# EAGLE design confBadgeV1 (EAGLE 9.6.2)
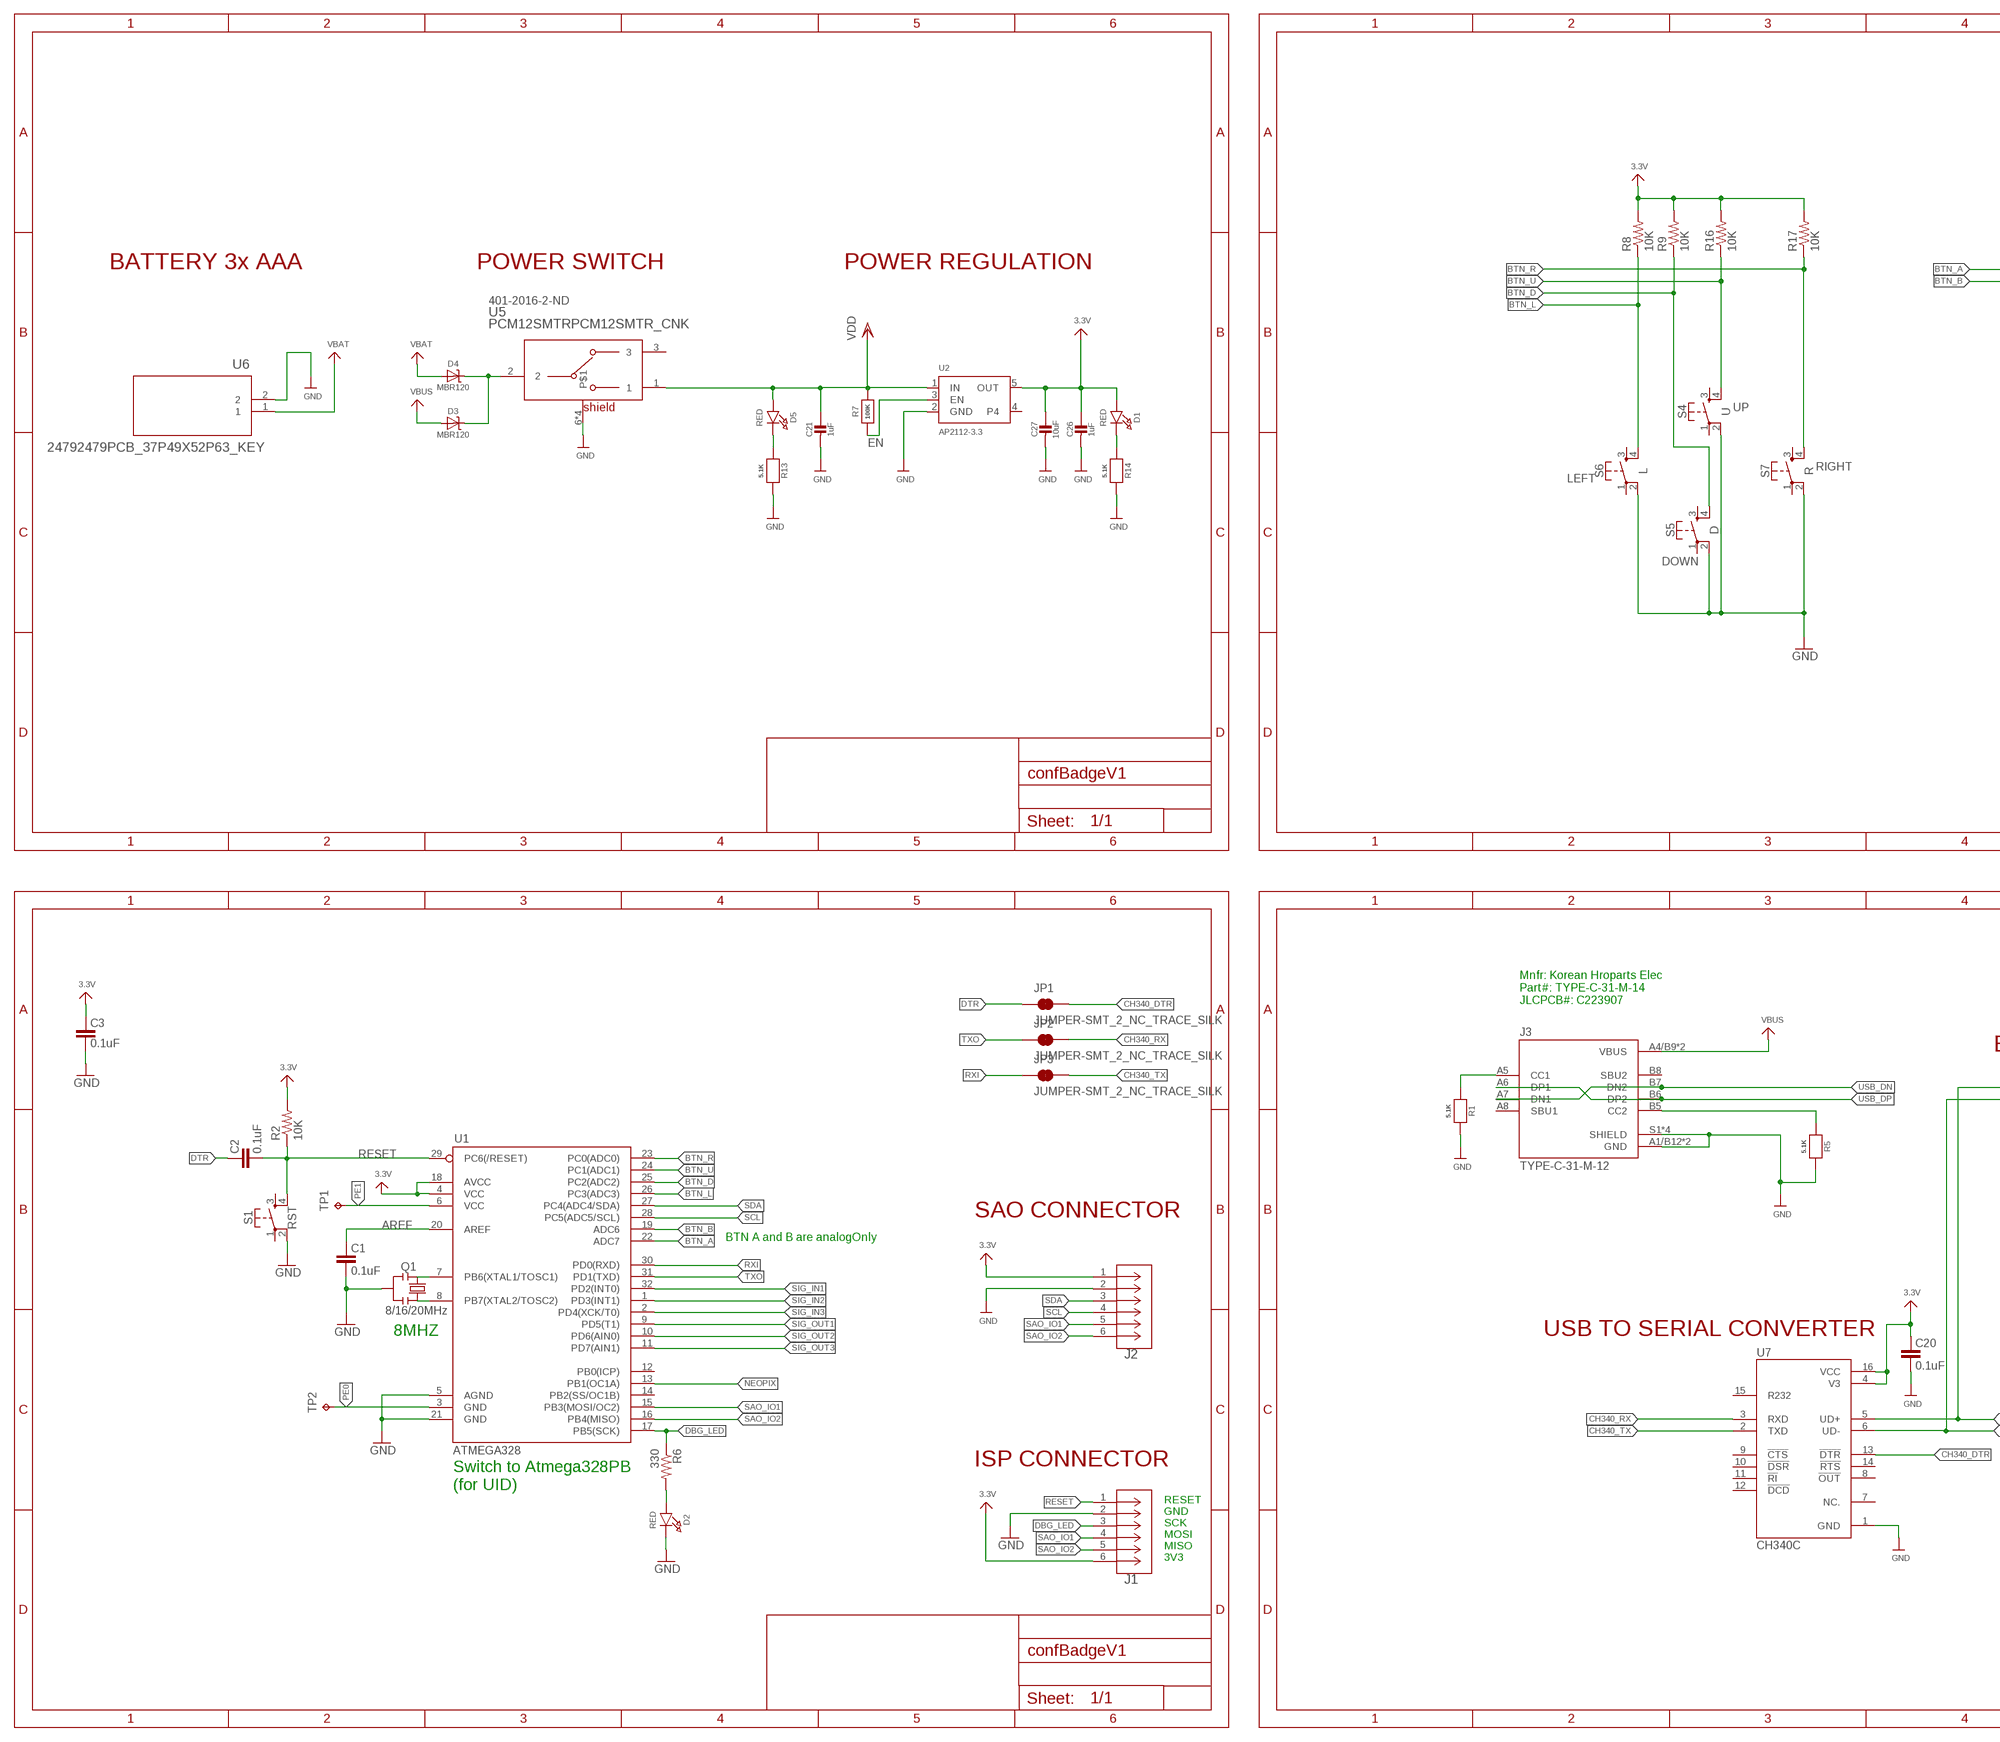
[diagram p0: schematic, sheet 1, part 1 of 2]
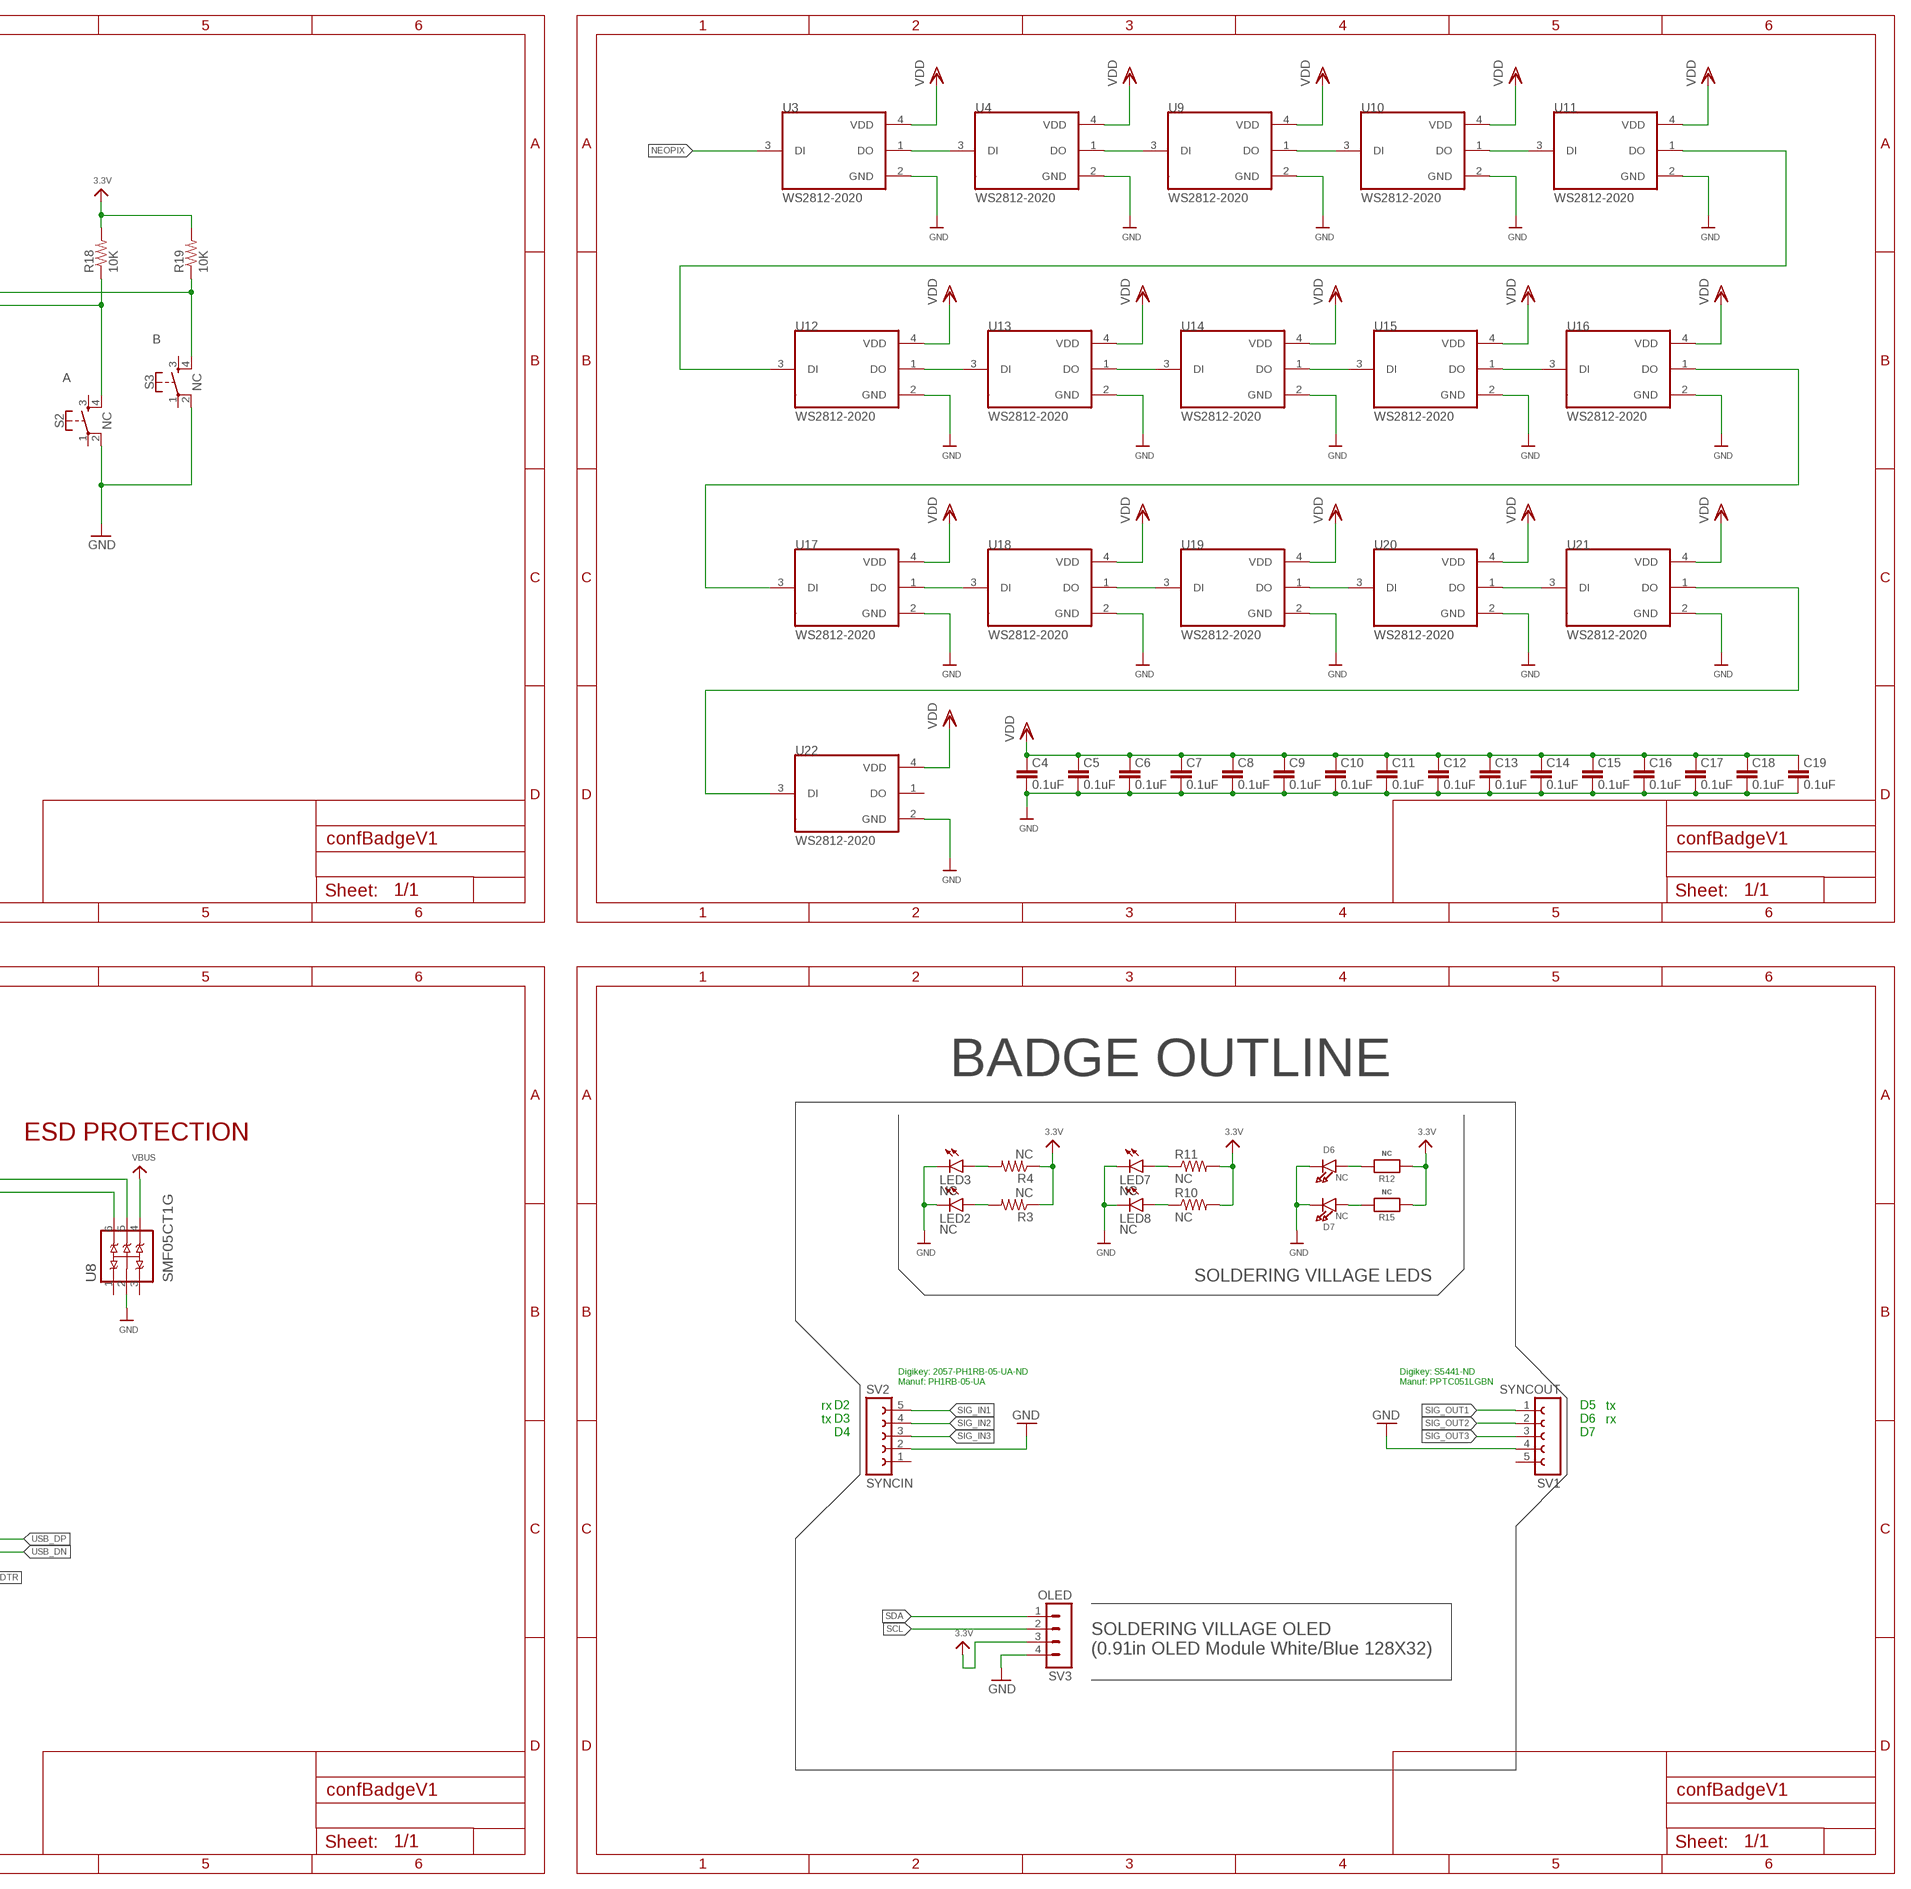
[diagram p1: schematic, sheet 1, part 2 of 2]

## Parts
C1  0.1uF  CAP0603-CAP  [0603-CAP]
C2  0.1uF  CAP0603-CAP  [0603-CAP]
C3  0.1uF  CAP0603-CAP  [0603-CAP]
C4  0.1uF  CAP0603-CAP  [0603-CAP]
C5  0.1uF  CAP0603-CAP  [0603-CAP]
C6  0.1uF  CAP0603-CAP  [0603-CAP]
C7  0.1uF  CAP0603-CAP  [0603-CAP]
C8  0.1uF  CAP0603-CAP  [0603-CAP]
C9  0.1uF  CAP0603-CAP  [0603-CAP]
C10  0.1uF  CAP0603-CAP  [0603-CAP]
C11  0.1uF  CAP0603-CAP  [0603-CAP]
C12  0.1uF  CAP0603-CAP  [0603-CAP]
C13  0.1uF  CAP0603-CAP  [0603-CAP]
C14  0.1uF  CAP0603-CAP  [0603-CAP]
C15  0.1uF  CAP0603-CAP  [0603-CAP]
C16  0.1uF  CAP0603-CAP  [0603-CAP]
C17  0.1uF  CAP0603-CAP  [0603-CAP]
C18  0.1uF  CAP0603-CAP  [0603-CAP]
C19  0.1uF  CAP0603-CAP  [0603-CAP]
C20  0.1uF  CAP0603-CAP  [0603-CAP]
C21  1uF  CAP_CERAMIC0603_NO  [0603-NO]
C26  1uF  CAP_CERAMIC0603_NO  [0603-NO]
C27  10uF  CAP_CERAMIC0805-NOOUTLINE  [0805-NO]
D1  RED  LED0805_NOOUTLINE  [CHIPLED_0805_NOOUTLINE]
D2  RED  LED0805_NOOUTLINE  [CHIPLED_0805_NOOUTLINE]
D3  MBR120  DIODE-SCHOTTKYSOD-123  [SOD-123]
D4  MBR120  DIODE-SCHOTTKYSOD-123  [SOD-123]
D5  RED  LED0805_NOOUTLINE  [CHIPLED_0805_NOOUTLINE]
D6  NC  LED0805_NOOUTLINE  [CHIPLED_0805_NOOUTLINE]
D7  NC  LED0805_NOOUTLINE  [CHIPLED_0805_NOOUTLINE]
J1  SSW-103-22-F-D-VS-K-TRCON3_SSW-D-DUMZ_HDR_SAI  [CON3_SSW-D-DUMZ_HDR_SAI]
J2  SSW-103-22-F-D-VS-K-TRCON3_SSW-D-DUMZ_HDR_SAI  [CON3_SSW-D-DUMZ_HDR_SAI]
J3  TYPE-C-31-M-12  [HRO_TYPE-C-31-M-12]
JP1  JUMPER-SMT_2_NC_TRACE_SILK  [SMT-JUMPER_2_NC_TRACE_SILK]
JP2  JUMPER-SMT_2_NC_TRACE_SILK  [SMT-JUMPER_2_NC_TRACE_SILK]
JP3  JUMPER-SMT_2_NC_TRACE_SILK  [SMT-JUMPER_2_NC_TRACE_SILK]
LED2  NC  LED3MM  [LED3MM]
LED3  NC  LED3MM  [LED3MM]
LED7  NC  LEDCHIPLED_1206  [CHIPLED_1206]
LED8  NC  LEDCHIPLED_1206  [CHIPLED_1206]
Q1  8/16/20MHz  RESONATOR1:1  [RESONATOR-SMD-1:1]
R1  5.1K  RESISTOR_0603_NOOUT  [0603-NO]
R2  10K  RESISTOR0603-RES  [0603-RES]
R3  NC  R-US_0207/10  [0207/10]
R4  NC  R-US_0207/10  [0207/10]
R5  5.1K  RESISTOR_0603_NOOUT  [0603-NO]
R6  330  RESISTOR0603-RES  [0603-RES]
R7  100K  RESISTOR_0603_NOOUT  [0603-NO]
R8  10K  RESISTOR0603-RES  [0603-RES]
R9  10K  RESISTOR0603-RES  [0603-RES]
R10  NC  R-US_R1206W  [R1206W]
R11  NC  R-US_R1206W  [R1206W]
R12  NC  RESISTOR_0603_NOOUT  [0603-NO]
R13  5.1K  RESISTOR_0603_NOOUT  [0603-NO]
R14  5.1K  RESISTOR_0603_NOOUT  [0603-NO]
R15  NC  RESISTOR_0603_NOOUT  [0603-NO]
R16  10K  RESISTOR0603-RES  [0603-RES]
R17  10K  RESISTOR0603-RES  [0603-RES]
R18  10K  RESISTOR0603-RES  [0603-RES]
R19  10K  RESISTOR0603-RES  [0603-RES]
S1  RST  MOMENTARY-SWITCH-SPST-2-SMD-5.2MM  [TACTILE_SWITCH_SMD_5.2MM]
S2  NC  MOMENTARY-SWITCH-SPST-2-SMD-5.2MM  [TACTILE_SWITCH_SMD_5.2MM]
S3  NC  MOMENTARY-SWITCH-SPST-2-SMD-5.2MM  [TACTILE_SWITCH_SMD_5.2MM]
S4  U  MOMENTARY-SWITCH-SPST-2-SMD-5.2MM  [TACTILE_SWITCH_SMD_5.2MM]
S5  D  MOMENTARY-SWITCH-SPST-2-SMD-5.2MM  [TACTILE_SWITCH_SMD_5.2MM]
S6  L  MOMENTARY-SWITCH-SPST-2-SMD-5.2MM  [TACTILE_SWITCH_SMD_5.2MM]
S7  R  MOMENTARY-SWITCH-SPST-2-SMD-5.2MM  [TACTILE_SWITCH_SMD_5.2MM]
SV1  SYNCOUT  FE05W  [FE05W]
SV2  SYNCIN  FE05W  [FE05W]
SV3  OLED  MA04-1  [MA04-1]
TP1  TPB1,27  [B1,27]
TP2  TPB1,27  [B1,27]
U1  ATMEGA328  ATMEGA168  [TQFP32-08]
U2  AP2112-3.3  VREG_SOT23-5  [SOT23-5]
U3  WS2812-2020  [LED_WS2812-2020]
U4  WS2812-2020  [LED_WS2812-2020]
U5  PCM12SMTRPCM12SMTR_CNK  [PCM12SMTR_CNK]
U6  24792479PCB_37P49X52P63_KEY  [2479PCB_37P49X52P63_KEY]
U7  CH340C  [SOIC127P600X180-16N]
U8  SMF05CT1G  [SOT65P210X110-6N]
U9  WS2812-2020  [LED_WS2812-2020]
U10  WS2812-2020  [LED_WS2812-2020]
U11  WS2812-2020  [LED_WS2812-2020]
U12  WS2812-2020  [LED_WS2812-2020]
U13  WS2812-2020  [LED_WS2812-2020]
U14  WS2812-2020  [LED_WS2812-2020]
U15  WS2812-2020  [LED_WS2812-2020]
U16  WS2812-2020  [LED_WS2812-2020]
U17  WS2812-2020  [LED_WS2812-2020]
U18  WS2812-2020  [LED_WS2812-2020]
U19  WS2812-2020  [LED_WS2812-2020]
U20  WS2812-2020  [LED_WS2812-2020]
U21  WS2812-2020  [LED_WS2812-2020]
U22  WS2812-2020  [LED_WS2812-2020]

## Nets
3.3V: C3.2 C20.2 C26.1 C27.1 D1.A J1.6 J2.1 R2.2 R3.1 R4.1 R8.2 R9.2 R10.2 R11.2 R12.1 R15.1 R16.2 R17.2 R18.2 R19.2 SV3.3 U1.4(VCC) U1.18(AVCC) U2.5(OUT) U7.4(V3) U7.16(VCC)
AREF: C1.2 U1.20(AREF)
BTN_A: R19.1 S3.4 U1.22(ADC7)
BTN_B: R18.1 S2.4 U1.19(ADC6)
BTN_D: R9.1 S5.4 U1.25(PC2(ADC2))
BTN_L: R8.1 S6.4 U1.26(PC3(ADC3))
BTN_R: R17.1 S7.4 U1.23(PC0(ADC0))
BTN_U: R16.1 S4.4 U1.24(PC1(ADC1))
CH340_DTR: JP1.2 U7.13(!DTR)
CH340_RX: JP2.2 U7.3(RXD)
CH340_TX: JP3.2 U7.2(TXD)
DBG_LED: J1.3 R6.1 U1.17(PB5(SCK))
DTR: C2.2 JP1.1
EN: R7.1 U2.3(EN)
GND [vcc]: C1.1 C3.1 C4.1 C5.1 C6.1 C7.1 C8.1 C9.1 C10.1 C11.1 C12.1 C13.1 C14.1 C15.1 C16.1 C17.1 C18.1 C19.1 C20.1 C21.2 C26.2 C27.2 D2.C D6.C D7.C J1.2 J2.2 J3.A1/B12(GND) J3.B1/A12(GND) J3.S1(SHIELD) J3.S2(SHIELD) J3.S3(SHIELD) J3.S4(SHIELD) LED2.K(C) LED3.K(C) LED7.C LED8.C Q1.2 R1.2 R5.2 R13.2 R14.2 S1.2 S2.2 S3.2 S4.2 S5.2 S6.2 S7.2 SV1.4 SV2.2 SV3.4 U1.5(AGND) U1.21(GND) U2.2(GND) U3.2(GND) U4.2(GND) U5.6 U5.7 U5.8 U5.9 U6.2 U7.1(GND) U8.2(A) U9.2(GND) U10.2(GND) U11.2(GND) U12.2(GND) U13.2(GND) U14.2(GND) U15.2(GND) U16.2(GND) U17.2(GND) U18.2(GND) U19.2(GND) U20.2(GND) U21.2(GND) U22.2(GND)
N$1: Q1.3 U1.8(PB7(XTAL2/TOSC2))
N$2: Q1.1 U1.7(PB6(XTAL1/TOSC1))
N$3: U4.1(DO) U9.3(DI)
N$4: U9.1(DO) U10.3(DI)
N$5: U3.1(DO) U4.3(DI)
N$6: U10.1(DO) U11.3(DI)
N$7: D2.A R6.2
N$8: U11.1(DO) U12.3(DI)
N$9: U12.1(DO) U13.3(DI)
N$10: U13.1(DO) U14.3(DI)
N$11: U14.1(DO) U15.3(DI)
N$12: U15.1(DO) U16.3(DI)
N$13: U16.1(DO) U17.3(DI)
N$14: U17.1(DO) U18.3(DI)
N$15: U18.1(DO) U19.3(DI)
N$16: U19.1(DO) U20.3(DI)
N$17: U20.1(DO) U21.3(DI)
N$18: D6.A R12.2
N$19: LED2.A R3.2
N$20: U21.1(DO) U22.3(DI)
N$21: LED3.A R4.2
N$22: D7.A R15.2
N$25: LED8.A R10.1
N$26: LED7.A R11.1
N$27: J3.B5(CC2) R5.1
N$30: J3.A5(CC1) R1.1
N$34: D3.C D4.C U5.2
N$35: D5.C R13.1
N$36: D1.C R14.1
NEOPIX: U1.13(PB1(OC1A)) U3.3(DI)
PE0: TP2.TP U1.3(GND)
PE1: TP1.TP U1.6(VCC)
RESET: C2.1 J1.1 R2.1 S1.4 U1.29(PC6(/RESET))
RXI: JP3.1 U1.30(PD0(RXD))
SAO_IO1: J1.4 J2.5 U1.15(PB3(MOSI/OC2))
SAO_IO2: J1.5 J2.6 U1.16(PB4(MISO))
SCL: J2.4 SV3.2 U1.28(PC5(ADC5/SCL))
SDA: J2.3 SV3.1 U1.27(PC4(ADC4/SDA))
SIG_IN1: SV2.5 U1.32(PD2(INT0))
SIG_IN2: SV2.4 U1.1(PD3(INT1))
SIG_IN3: SV2.3 U1.2(PD4(XCK/T0))
SIG_OUT1: SV1.1 U1.9(PD5(T1))
SIG_OUT2: SV1.2 U1.10(PD6(AIN0))
SIG_OUT3: SV1.3 U1.11(PD7(AIN1))
TXO: JP2.1 U1.31(PD1(TXD))
USB_DN: J3.A7(DN1) J3.B7(DN2) U7.6(UD-) U8.6(C5)
USB_DP: J3.A6(DP1) J3.B6(DP2) U7.5(UD+) U8.5(C4)
VBAT: D4.A U6.1
VBUS: D3.A J3.A4/B9(VBUS) J3.B4/A9(VBUS) U8.4(C3)
VDD: C4.2 C5.2 C6.2 C7.2 C8.2 C9.2 C10.2 C11.2 C12.2 C13.2 C14.2 C15.2 C16.2 C17.2 C18.2 C19.2 C21.1 D5.A R7.2 U2.1(IN) U3.4(VDD) U4.4(VDD) U5.1 U9.4(VDD) U10.4(VDD) U11.4(VDD) U12.4(VDD) U13.4(VDD) U14.4(VDD) U15.4(VDD) U16.4(VDD) U17.4(VDD) U18.4(VDD) U19.4(VDD) U20.4(VDD) U21.4(VDD) U22.4(VDD)
Unconnected: J3.A8(SBU1) J3.B8(SBU2) S1.1 S1.3 S2.1 S2.3 S3.1 S3.3 S4.1 S4.3 S5.1 S5.3 S6.1 S6.3 S7.1 S7.3 SV1.5 SV2.1 U1.12(PB0(ICP)) U1.14(PB2(SS/OC1B)) U2.4 U5.3 U7.7(NC.) U7.8(!OUT) U7.9(!CTS) U7.10(!DSR) U7.11(!RI) U7.12(!DCD) U7.14(!RTS) U7.15(R232) U8.1(C1) U8.3(C2) U22.1(DO)

## Notes on the sheet
- BATTERY 3x AAA | POWER SWITCH | POWER REGULATION
- 401-2016-2-ND
- B
- A
- UP
- RIGHT
- LEFT
- DOWN
- BADGE OUTLINE
- Mnfr: Korean Hroparts Elec
  Part#: TYPE-C-31-M-14
  JLCPCB#: C223907
- ESD PROTECTION
- SOLDERING VILLAGE LEDS
- SAO CONNECTOR
- BTN A and B are analogOnly
- Digikey: 2057-PH1RB-05-UA-ND
  Manuf: PH1RB-05-UA
- Digikey: S5441-ND
  Manuf: PPTC051LGBN
- rx
  tx
- tx
  rx
- D2
  D3
  D4
- D5
  D6
  D7
- 8MHZ | USB TO SERIAL CONVERTER
- ISP CONNECTOR
- Switch to Atmega328PB
  (for UID)
- SOLDERING VILLAGE OLED
  (0.91in OLED Module White/Blue 128X32)
- RESET
  GND
  SCK
  MOSI
  MISO
  3V3

## Library data of the parts
C1-C20 = SparkFun:CAP: Capacitor Standard 0603 ceramic capacitor, and 0.1" leaded capacitor.
C21 C26 C27 = microbuilder:CAP_CERAMIC: Ceramic Capacitors For new designs, use the packages preceded by an '_' character since they are more reliable: The following footprints should be used on most boards: _0402 - Standard footprint for regular board layouts _0603 - Standard footprint for regular board layouts _0805 - Standard footprint for regular board layouts _1206 - Standard footprint for regular board layouts For extremely tight-pitch boards where space is at a premium, the following 'micro-pitch' footprints can be used (smaller pads, no silkscreen outline, etc.): _0402MP - Micro-pitch footprint for very dense/compact boards _0603MP - Micro-pitch footprint for very dense/compact boards _0805MP - Micro-pitch footprint for very dense/compact boards _1206MP - Micro-pitch footprint for very dense/compact boards
D1 D2 D5-D7 = microbuilder:LED: LED
D3 D4 = microbuilder:DIODE-SCHOTTKY
J1 J2 = SSW-103-22-F-D-VS-K-TR:SSW-103-22-F-D-VS-K-TR; COPYRIGHT: Copyright (C) 2022 Ultra Librarian. All rights reserved.; DIGI-KEY_PART_NUMBER_1: SAM14622CT-ND; DIGI-KEY_PART_NUMBER_2: SAM14622DKR-ND; DIGI-KEY_PART_NUMBER_3: SAM14622TR-ND; MANUFACTURER_PART_NUMBER: SSW-103-22-F-D-VS-K-TR; MFR_NAME: Samtec Inc
J3 = TYPE-C-31-M-12:TYPE-C-31-M-12; MANUFACTURER: HRO Electronics Co., Ltd.; MAXIMUM_PACKAGE_HEIGHT: 3.26 mm; PARTREV: 2020.12.08; SNAPEDA_PN: TYPE-C-31-M-12; STANDARD: Manufacturer Recommendations
JP1-JP3 = SparkFun-Jumpers:JUMPER-SMT_2_NC_TRACE: Normally closed trace jumper This jumper has a trace between two pads so it's normally closed (NC). Use a razor knife to open the connection. For best results follow the IPC guidelines for cutting traces: Cutout at least 0.063 mm (0.005 in). Remove all loose material to clean up the cut area. Seal the cut with an approved epoxy. Reapply solder to reclose the connection.
LED2 LED3 LED7 LED8 = led:LED: LED
Q1 = Testing:RESONATOR: Resonator Small SMD resonator. This is the itty bitty 10/20MHz resonators with built in caps. CSTCE10M0G55 and CSTCE20M0V53. Footprint for SMD has been used in SFE production for years, and does work okay. 1:1 is an attempt to get larger fillets on the sides so it will be easier to inspect these solders in our AOI machine. The pads have been minimized to match the actual metal under the resonator. To see this relation, it includes an image import of the bottom side of the component. Imported to scale on layer 200.
R1 R5 R7 R12-R15 = microbuilder:RESISTOR: Resistors For new designs, use the packages preceded by an '_' character since they are more reliable: The following footprints should be used on most boards: _0402 - Standard footprint for regular board layouts _0603 - Standard footprint for regular board layouts _0805 - Standard footprint for regular board layouts _1206 - Standard footprint for regular board layouts For extremely tight-pitch boards where space is at a premium, the following 'micro-pitch' footprints can be used (smaller pads, no silkscreen outline, etc.): _0402MP - Micro-pitch footprint for very dense/compact boards _0603MP - Micro-pitch footprint for very dense/compact boards _0805MP - Micro-pitch footprint for very dense/compact boards _1206MP - Micro-pitch footprint for very dense/compact boards
R2 R6 R8 R9 R16-R19 = SparkFun:RESISTOR: Resistor Basic schematic elements and footprints for 0603, 1206, and PTH resistors.
R3 R4 R10 R11 = rcl:R-US_: RESISTOR, American symbol; SPICEPREFIX: R
S1-S7 = SparkFun-Switches:MOMENTARY-SWITCH-SPST-2: Momentary Switch (Pushbutton) - SPST - Two Circuits Normally-open (NO) SPST momentary switches (buttons, pushbuttons). Schematic symbol includes two switch circuits. Variants SMD-4.6MMX2.8MM - 4.60mm x 2.80mm Tactile Momentary Button Switch - Used on SparkFun SAMD21 Mini Breakout <https://www.sparkfun.com/products/13664> SMD-5.2MM - Mini Pushbutton Switch - SMD <https://www.sparkfun.com/products/8720> - Used on Arduino Pro Mini <https://www.sparkfun.com/products/11114>; PROD_ID: SWCH-08247; SF_SKU: COM-08720
SV1 SV2 = con-lsta:FE05W: FEMALE HEADER; OC_FARNELL: unknown; OC_NEWARK: unknown
SV3 = con-lstb:MA04-1: PIN HEADER; OC_FARNELL: unknown; OC_NEWARK: unknown
TP1 TP2 = testpad:TP: Test pad
U1 = SparkFun:ATMEGA168
U2 = microbuilder:VREG_SOT23-5: SOT23-5 Fixed Voltage Regulators Part Current Out V Out V In V Dropout θJA (°C/W) TJ (°C) Digikey Part No. ADP121 150mA 3.3V 3.4-5.5V 0.09V @ 150mA -- -- ADP121-AUJZ33R7CT-ND ADP121 150mA 3.0V 3.1-5.5V 0.09V @ 150mA -- -- ADP121-AUJZ30R7CT-ND ADP122 300mA 3.3V 3.4-5.5V 0.085V @ 300mA -- -- ADP122AUJZ-3.3-R7CT-ND ADP1712 300mA 3.3V 3.5-5.5V 0.17V @ 300mA -- -- ADP1712AUJZ-3.3-R7TR-ND AP7311 (Low Cost) 150mA 3.3V 3.5-6V 0.15V @ 150mA -- -- AP7311-33WG-7DICT-ND LD39015M18R 150mA 1.8V 1.9V-5.5V 0.08V @ 100mA -- -- 497-6977-1-ND LP2985A-33DBVR 150mA 3.3V 3.3-16V 0.28V @ 150mA 206 150 296-18479-1-ND MCP1824T-3302E/OT 300mA 3.3V 3.5V-6V 0.2V @ 300mA -- -- MCP1824T-3302E/OTCT-ND MIC5205-2.5YM5 TR 150mA 2.5V 2.7-16V 0.165V @ 150mA -- -- 576-1257-2-ND MIC5205-3.0YM5 TR 150mA 3.0V 3.2V-16V 0.165V @ 150mA -- -- 576-1258-2-ND MIC5205-3.3YM5 TR 150mA 3.3V 3.5V-16V 0.165V @ 150mA -- -- 576-1259-2-ND TPS780330220 150mA 3.3V+2.2V 3.6-5.5V 250mV Max -- -- 296-23332-1-ND TDA3663/N1,135 100mA 3.3V 3.5-45V 0.18V @ 50mA -- -- 568-5343-1-ND Max operating temp can be calculated using θJA, TJ (max junction temperature), and power in watts. Set the "Maximum Ambient Temperature" until it reaches TJ ("Max Junction Temperature"), which is the absolute limit for safe use of the regulator: Heat Sink Temperature Calculator <http://www.daycounter.com/Calculators/Heat-Sink-Temperature-Calculator.phtml> For example, With 12V source into a 3.3V LP2985 and a 30mA load, we are dissipating (12V-3.3V) * 0.03A = 0.261W. With a θJA of 206 °C/W, a TJ of 150°C, and 261mW we can safely use the chip without a heat sink up to 75°C (=147.1°C Junction Temperature).
U3 U4 U9-U22 = WS2812-2020:WS2812-2020: Intelligent control LED integrated light source Check availability <https://pricing.snapeda.com/parts/WS2812-2020/Worldsemi/view-part?ref=eda>; AVAILABILITY: Not in stock; DESCRIPTION: Intelligent control LED light source, SMD-4; MF: Worldsemi; MP: WS2812-2020; PACKAGE: Package; PRICE: None
U5 = 401-2016-2-ND:PCM12SMTR; COPYRIGHT: Copyright (C) 2022 Ultra Librarian. All rights reserved.; DIGI-KEY_PART_NUMBER_1: 401-2016-2-ND; DIGI-KEY_PART_NUMBER_2: 401-2016-1-ND; DIGI-KEY_PART_NUMBER_3: 401-2016-6-ND; DIGI-KEY_PART_NUMBER_4: 2266-PCM12SMTR-ND; MANUFACTURER_PART_NUMBER: PCM12SMTR; MFR_NAME: C&K
U6 = 36-2479-ND_AAA-3x:2479; COPYRIGHT: Copyright (C) 2022 Ultra Librarian. All rights reserved.; DIGI-KEY_PART_NUMBER_1: 1528-1350-ND; DIGI-KEY_PART_NUMBER_2: 2183-2479-ND; DIGI-KEY_PART_NUMBER_3: 2479K-ND; DIGI-KEY_PART_NUMBER_4: 36-2479-ND; DIGI-KEY_PART_NUMBER_5: 36-2479-NDL; MANUFACTURER_PART_NUMBER: 2479; MFR_NAME: Keystone Electronics
U7 = CH340C:CH340C: USB to serial chip CH340 Check prices <https://pricing.snapeda.com/parts/CH340C/WCH/view-part?ref=eda>; AVAILABILITY: Not in stock; DESCRIPTION: USB to serial chip CH340; MF: WCH; MP: CH340C; PACKAGE: None; PRICE: None
U8 = SMF05CT1G:SMF05CT1G: SMF05C Series 7.2 V 100 W 5-Line Transient Voltage Suppressor Array - SC-88 Check prices <https://pricing.snapeda.com/parts/SMF05CT1G/ON%20Semiconductor/view-part?ref=eda>; AVAILABILITY: In Stock; DESCRIPTION: 12.5V Clamp 8A (8/20µs) Ipp Tvs Diode Surface Mount SC-88/SC70-6/SOT-363; MF: ON Semiconductor; MP: SMF05CT1G; PACKAGE: SC-88-6 ON Semiconductor; PRICE: None; PURCHASE-URL: https://pricing.snapeda.com/search/part/SMF05CT1G/?ref=eda

## Net classes
1 vcc: width 0.254 mm

## Board
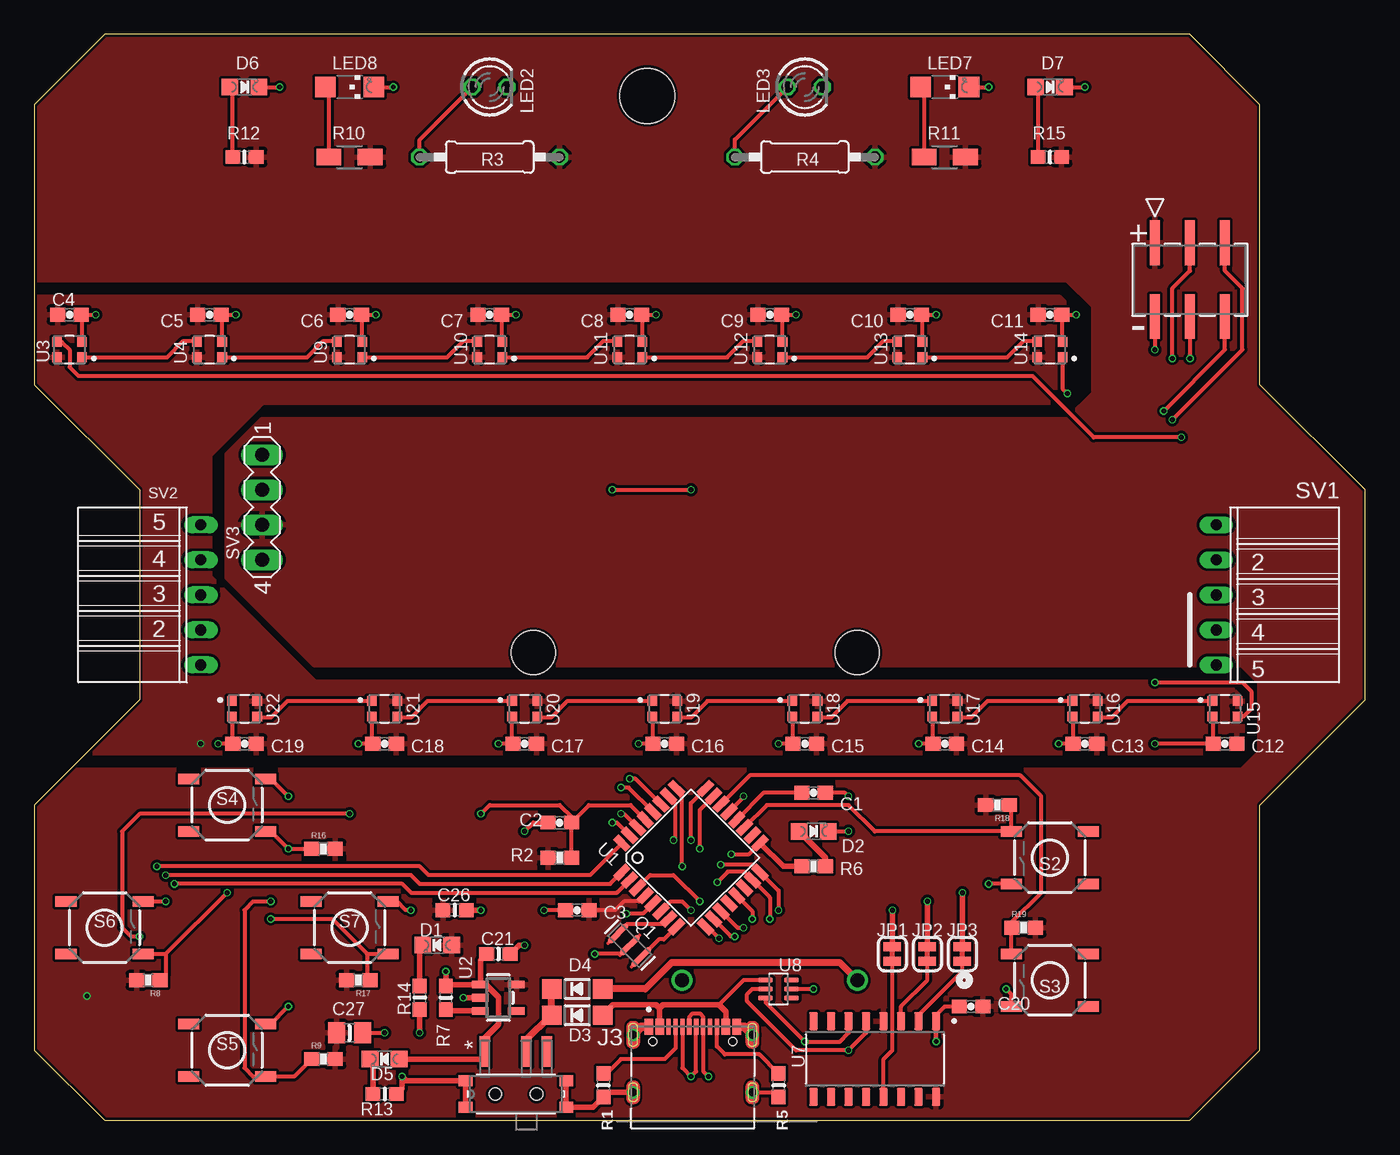
[diagram p2: board, top side]
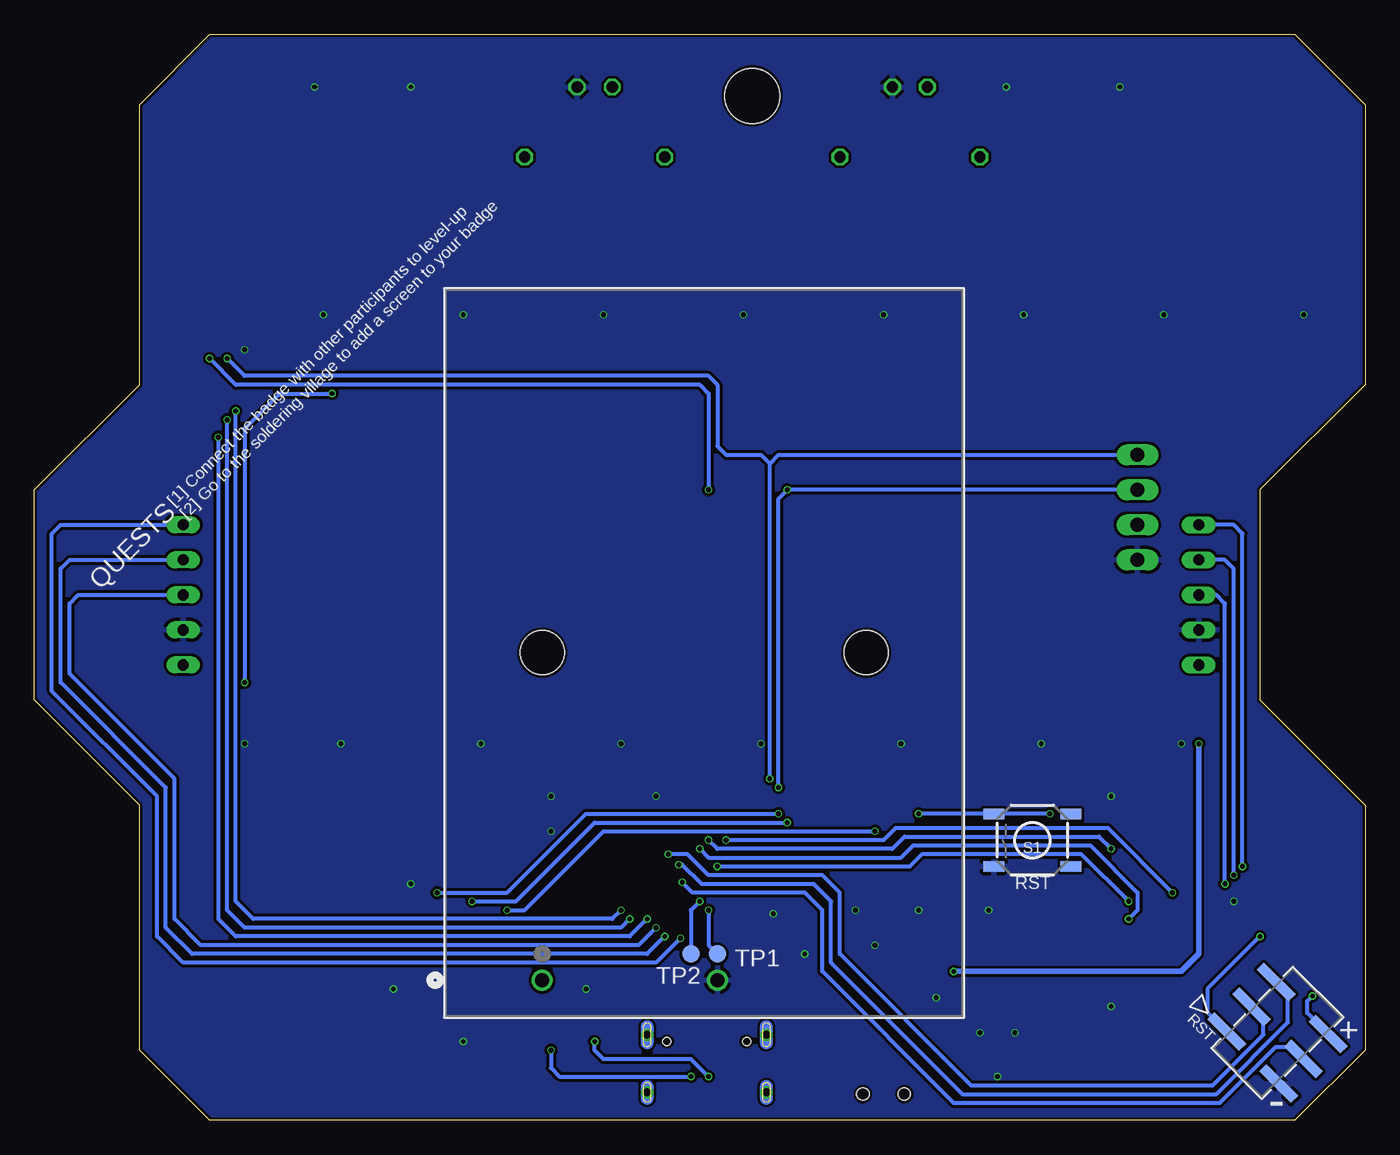
[diagram p3: board, bottom side, seen from below]

Size 96.52 x 78.74 mm. Coordinates in mm from the lower left corner, seen from the top.
Outline: 0,5.08 5.08,0 83.82,0 88.9,5.08 88.9,22.86 96.52,30.48 96.52,45.72 88.9,53.34 88.9,73.66 83.82,78.74 5.08,78.74 0,73.66 0,53.34 7.62,45.72 7.62,30.48 0,22.86 0,5.08
Copper layers (1*16): Top 0.035mm / dielectric 0.2mm / Bottom 0.035mm
Design rules "JLC_2Layer_(workInProgress)": minimum track width 3.5mil, minimum drill 0.2mm, track to track 3.5mil, track to pad 5mil, pad to pad 5mil, via to via 5mil, smd to smd 0mil, copper to edge 0.2mm, drill to drill 0.2mm, minimum pad ring 3mil, minimum via ring 3mil, stop-mask expansion 0mil, vias tented up to drill 100mil, thermal gap 10mil
Holes 4 mm at 44.45,74.3

### Footprints (pad centres in the part's own frame; a part is rotated, then mirrored left to right if it is on the bottom)
0603-CAP = smd 1.1 x 1: 1 -0.85,0; 2 0.85,0
0603-NO = smd 1.075 x 1: 1 -0.85,0; 2 0.85,0
0805-NO = smd 1.24 x 1.5: 1 -0.95,0; 2 0.95,0
CHIPLED_0805_NOOUTLINE = smd 1.2 x 1.2: A 0,-1.05; C 0,1.05
SOD-123 = smd 1.4 x 1.4: A 1.85,0; C -1.85,0
CON3_SSW-D-DUMZ_HDR_SAI = smd 0.737 x 3.251: 1 2.54,-2.667; 2 2.54,2.667; 3 0,-2.667; 4 0,2.667; 5 -2.54,-2.667; 6 -2.54,2.667
HRO_TYPE-C-31-M-12 = smd 0.6 x 1.14: A1/B12 -3.2,4.75; A4/B9 -2.4,4.75; B1/A12 3.2,4.75; B4/A9 2.4,4.75 | smd 0.3 x 1.14: A5 -1.25,4.75; A6 -0.25,4.75; A7 0.25,4.75; A8 1.25,4.75; B5 1.75,4.75; B6 0.75,4.75; B7 -0.75,4.75; B8 -1.75,4.75 | drill 0.6 pad 0.9: S1 -4.325,4.17; S2 4.325,4.17; S3 -4.325,0; S4 4.325,0 | hole 0.6: -2.89,3.68; 2.89,3.68
SMT-JUMPER_2_NC_TRACE_SILK = smd 0.66 x 1.27: 1 -0.521,0; 2 0.521,0
LED3MM = drill 0.813 octagon: A -1.27,0; K 1.27,0
CHIPLED_1206 = smd 1.5 x 1.5: A 0,-1.75; C 0,1.75
RESONATOR-SMD-1:1 = smd 0.45 x 1.905: 1 -1.2,0; 2 0,0; 3 1.2,0
0603-RES = smd 1.1 x 1: 1 -0.85,0; 2 0.85,0
0207/10 = drill 0.813 octagon: 1 -5.08,0; 2 5.08,0
R1206W = smd 1.8 x 1.2: 1 -1.499,0; 2 1.499,0
TACTILE_SWITCH_SMD_5.2MM = smd 1.524 x 0.762: 1 -2.794,1.905; 2 2.794,1.905; 3 -2.794,-1.905; 4 2.794,-1.905
FE05W = drill 0.813 long: 1 -5.08,0; 2 -2.54,0; 3 0,0; 4 2.54,0; 5 5.08,0
MA04-1 = drill 1.016 long: 1 -3.81,0; 2 -1.27,0; 3 1.27,0; 4 3.81,0
B1,27 = smd 1.27 x 1.27: TP 0,0
TQFP32-08 = smd 1.27 x 0.559: 1 -4.293,2.8; 2 -4.293,2; 3 -4.293,1.2; 4 -4.293,0.4; 5 -4.293,-0.4; 6 -4.293,-1.2; 7 -4.293,-2; 8 -4.293,-2.8; 17 4.293,-2.8; 18 4.293,-2; 19 4.293,-1.2; 20 4.293,-0.4; 21 4.293,0.4; 22 4.293,1.2; 23 4.293,2; 24 4.293,2.8 | smd 0.559 x 1.27: 9 -2.8,-4.293; 10 -2,-4.293; 11 -1.2,-4.293; 12 -0.4,-4.293; 13 0.4,-4.293; 14 1.2,-4.293; 15 2,-4.293; 16 2.8,-4.293; 25 2.8,4.293; 26 2,4.293; 27 1.2,4.293; 28 0.4,4.293; 29 -0.4,4.293; 30 -1.2,4.293; 31 -2,4.293; 32 -2.8,4.293
SOT23-5 = smd 0.55 x 1.2: 1 -0.95,-1.3; 2 0,-1.3; 3 0.95,-1.3; 4 0.95,1.3; 5 -0.95,1.3
LED_WS2812-2020 = smd 0.7 x 0.7: 1 -0.915,0.55; 2 -0.915,-0.55; 3 0.915,-0.55; 4 0.915,0.55
PCM12SMTR_CNK = smd 2.21 x 0.762: 1 3.101,2.25; 2 3.101,-0.75; 3 3.101,-2.25 | smd 0.813 x 0.991: 6 -0.965,3.65; 7 0.965,3.65; 8 -0.965,-3.65; 9 0.965,-3.65 | hole 0.9: 0,1.499; 0,-1.499
2479PCB_37P49X52P63_KEY = drill 1.016 pad 1.524: 1 0,0; 2 12.7,0 | hole 3.2: 0,23.749; 23.495,23.749
SOIC127P600X180-16N = smd 1.31 x 0.62: 1 -2.75,4.445; 2 -2.75,3.175; 3 -2.75,1.905; 4 -2.75,0.635; 5 -2.75,-0.635; 6 -2.75,-1.905; 7 -2.75,-3.175; 8 -2.75,-4.445; 9 2.75,-4.445; 10 2.75,-3.175; 11 2.75,-1.905; 12 2.75,-0.635; 13 2.75,0.635; 14 2.75,1.905; 15 2.75,3.175; 16 2.75,4.445
SOT65P210X110-6N = smd 1.06 x 0.39: 1 -0.935,0.65; 2 -0.935,0; 3 -0.935,-0.65; 4 0.935,-0.65; 5 0.935,0; 6 0.935,0.65

### Placement (x,y rotation side)
C1  56.52,23.75 180 top
C2  38.1,21.59 180 top
C3  39.37,15.24 0 top
C4  2.54,58.42 180 top
C5  12.7,58.42 180 top
C6  22.86,58.42 180 top
C7  33.02,58.42 180 top
C8  43.18,58.42 180 top
C9  53.34,58.42 180 top
C10  63.5,58.42 180 top
C11  73.66,58.42 180 top
C12  86.36,27.3 0 top
C13  76.2,27.3 0 top
C14  66.04,27.3 0 top
C15  55.88,27.3 0 top
C16  45.72,27.3 0 top
C17  35.56,27.3 0 top
C18  25.4,27.3 0 top
C19  15.24,27.3 0 top
C20  67.94,8.26 0 top
C21  33.66,12.06 0 top
C26  30.48,15.24 0 top
C27  22.86,6.35 0 top
D1  29.21,12.7 90 top
D2  56.52,20.95 270 top
D3  39.37,7.62 0 top
D4  39.37,9.53 0 top
D5  25.4,4.45 90 top
D6  15.24,74.93 270 top
D7  73.66,74.93 270 top
J1  6.35,6.35 225 bottom
J2  83.82,60.96 180 top
J3  47.75,2.03 0 top
JP1  62.23,12.06 270 top
JP2  64.77,12.06 270 top
JP3  67.31,12.06 270 top
LED2  33.02,74.93 0 top
LED3  55.88,74.93 0 top
LED7  66.04,74.93 270 top
LED8  22.86,74.93 270 top
Q1  43.18,12.7 315 top
R1  41.27,2.54 270 top
R2  38.1,19.05 180 top
R3  33.02,69.85 180 top
R4  55.88,69.85 180 top
R5  53.98,2.54 270 top
R6  56.52,18.41 0 top
R7  29.84,8.89 90 top
R8  8.26,10.16 180 top
R9  20.95,4.45 0 top
R10  22.86,69.85 0 top
R11  66.04,69.85 0 top
R12  15.24,69.85 180 top
R13  25.4,1.91 0 top
R14  27.94,8.89 270 top
R15  73.66,69.85 180 top
R16  20.95,19.68 0 top
R17  23.5,10.16 180 top
R18  69.85,22.86 180 top
R19  71.75,13.97 0 top
S1  24.13,20.32 180 bottom
S2  73.66,19.05 180 top
S3  73.66,10.16 180 top
S4  13.97,22.86 0 top
S5  13.97,5.08 0 top
S6  5.08,13.97 0 top
S7  22.86,13.97 0 top
SV1  85.72,38.1 270 top
SV2  12.06,38.1 90 top
SV3  16.51,44.45 270 top
TP1  46.99,12.06 0 bottom
TP2  48.9,12.06 0 bottom
U1  47.62,19.05 45 top
U2  33.66,8.89 270 top
U3  2.54,55.88 180 top
U4  12.7,55.88 180 top
U5  34.92,1.91 90 top
U6  59.69,10.16 0 bottom
U7  60.96,4.45 270 top
U8  53.98,9.53 180 top
U9  22.86,55.88 180 top
U10  33.02,55.88 180 top
U11  43.18,55.88 180 top
U12  53.34,55.88 180 top
U13  63.5,55.88 180 top
U14  73.66,55.88 180 top
U15  86.36,29.84 0 top
U16  76.2,29.84 0 top
U17  66.04,29.84 0 top
U18  55.88,29.84 0 top
U19  45.72,29.84 0 top
U20  35.56,29.84 0 top
U21  25.4,29.84 0 top
U22  15.24,29.84 0 top

### Tracks (layer width: path | path; a pad name or v marks a point on that pad's centre or on a via)
3.3V  (via drill 0.35)
  Top 0.305: U1.4 43.88,15.88 42.76,15.88 42.12,15.24 C3.2
  Bottom 0.305: J1.6 4.19,7.78 4.19,8.64 v3.81,9.02
  pour Top (isolate 0.203): 0,22.86 2.54,25.4 87.63,25.4 88.9,26.67 88.9,31.75 87.63,33.02 20.32,33.02 13.97,39.37 13.97,48.26 16.51,50.8 74.93,50.8 76.83,52.7 76.83,59.05 74.93,60.96 0,60.96 0,73.66 5.08,78.74 83.82,78.74 88.9,73.66 88.9,53.34 96.52,45.72 96.52,30.48 88.9,22.86 88.9,5.08 83.82,0 5.08,0 0,5.08
AREF
  Top 0.305: U1.20 52.89,23.75 C1.2
BTN_A
  Top 0.305: U1.22 51.9,25.02 71.5,25.02 73.03,23.5 73.03,16.51 70.91,14.39 R19.1 70.87,13.93 S3.4
BTN_B
  Top 0.305: U1.19 53.13,22.86 59.05,22.86 60.96,20.95 S2.4 70.87,22.69 R18.1
BTN_D  (via drill 0.35)
  Top 0.305: v46.99,18.41 46.99,23.64 U1.25 | v17.14,15.88 15.88,15.88 15.24,15.24 15.24,3.81 15.88,3.17 S5.4 18.84,3.17 R9.1
  Bottom 0.305: v46.99,18.41 33.02,18.41 32.11,19.33 20.6,19.33 v17.14,15.88
BTN_L  (via drill 0.35)
  Top 0.305: S6.4 9.53,12.06 | U1.26 46.46,23.05 46.46,20.42 v46.35,20.32 | v13.97,16.51 9.53,12.06 | 9.53,12.06 9.53,10.58 R8.1
  Bottom 0.305: v46.35,20.32 34.92,20.32 34.04,21.21 18.67,21.21 v13.97,16.51
BTN_R  (via drill 0.35)
  Top 0.305: v48.26,19.68 48.26,22.51 U1.23 | v17.14,14.61 21.59,14.61 24.13,12.06 | 24.13,12.06 S7.4 | R17.1 24.13,10.38 24.13,12.06
  Bottom 0.305: v48.26,19.68 47.62,19.05 33.66,19.05 32.77,19.94 19.94,19.94 16.51,16.51 16.51,15.24 v17.14,14.61
BTN_U  (via drill 0.35)
  Top 0.305: S4.4 17.14,20.95 v18.41,19.68 R16.1 | v47.62,20.32 47.62,23.01 U1.24
  Bottom 0.305: v47.62,20.32 46.99,19.68 34.29,19.68 33.4,20.57 19.3,20.57 v18.41,19.68
CH340_DTR
  Top 0.305: U7.13 61.59,4.45 62.23,5.08 JP1.2
CH340_RX
  Top 0.305: U7.3 62.87,8.26 64.77,10.16 JP2.2
CH340_TX
  Top 0.305: U7.2 64.14,7.62 67.31,10.79 JP3.2
DBG_LED  (via drill 0.35)
  Top 0.305: U1.17 51.84,19.3 v50.55,19.3
  Top 0.406: U1.17 54.33,18.41 R6.1
  Bottom 0.305: v50.55,19.3 49.15,19.3 47.62,17.78 39.37,17.78 38.1,16.51 38.1,12.06 28.57,2.54 11.05,2.54 7.37,6.22 7.37,7.37 J1.3
DTR  (via drill 0.35)
  Top 0.305: v35.56,20.95 36.2,21.59 C2.2
  Top 0.406: JP1.1 v62.23,15.24
  Bottom 0.305: v35.56,20.95 55.24,20.95 60.96,15.24 v62.23,15.24
EN
  Top 0.406: U2.3 29.95,7.94 R7.1
GND  (via drill 0.35)
  Top 0.305: U1.5 44.13,14.99 v42.93,14.99 | Q1.2 42.55,12.06 v40.64,12.06 | U3.2 3.46,58.35 C4.1 v4.45,58.42 | U4.2 13.62,58.35 C5.1 v14.61,58.42 | U9.2 23.77,58.35 C6.1 v24.77,58.42 | U10.2 33.94,58.35 C7.1 v34.92,58.42 | U11.2 44.09,58.35 C8.1 v45.09,58.42 | U12.2 54.26,58.35 C9.1 v55.24,58.42 | U13.2 64.42,58.35 C10.1 v65.41,58.42 | U14.2 74.58,58.35 C11.1 v75.56,58.42 | U22.2 14.39,29.23 C19.1 v13.34,27.3 | U21.2 24.48,27.37 C18.1 v23.5,27.3 | U20.2 34.65,27.37 C17.1 v33.66,27.3 | U19.2 44.87,29.23 C16.1 v43.81,27.3 | U18.2 55.03,29.23 C15.1 v53.98,27.3 | U17.2 65.19,29.23 C14.1 v64.14,27.3 | U16.2 75.35,29.23 C13.1 v74.3,27.3 | U15.2 85.51,29.23 C12.1 v81.28,27.3 | LED7.C v69.22,74.93 | LED8.C v26.04,74.93 | D7.C v76.2,74.93 | D6.C v17.78,74.93 | S3.2 70.87,9.14 v70.48,9.53 | U7.1 v65.41,5.71 65.41,7.62 66.04,8.26 C20.1 | S2.2 v69.22,17.14 | S6.2 v9.53,15.88 | v27.3,15.24 26.92,15.24 26.29,15.88 S7.2 | S5.2 17.14,6.99 v18.41,8.26 | v18.41,23.5 17.14,24.77 S4.2 | v59.05,23.5 58.8,23.75 C1.1 | D2.C v59.05,20.95 | U1.21 51.44,23.43 v51.44,23.5 | C27.2 v25.4,6.35 | J3.S4 53.63,2.03 R5.2 | U8.2 v56.52,9.53 | C3.1 v36.96,15.24 | J2.2 v81.28,55.88
  Top 0.406: U5.6 U5.7 26.98,2.87 v26.67,3.17 26.67,2.33 R13.2 | R14.2 v27.94,6.35 | C26.2 v32.38,15.24 | U2.2 v31.11,8.89 | C21.2 35.14,12.7 v35.56,12.7 | J3.S3 41.62,2.03 R1.2 40.52,0.94 U5.8 U5.9
  Top 0.61: J3.A1/B12 44.01,6.78 J3.S1 | J3.B1/A12 51.5,6.78 J3.S2
  pour Bottom (isolate 0.203): 0,5.08 0,22.86 7.62,30.48 7.62,45.72 0,53.34 0,73.66 5.08,78.74 83.82,78.74 88.9,73.66 88.9,53.34 96.52,45.72 96.52,30.48 88.9,22.86 88.9,5.08 83.82,0 5.08,0
N$1
  Top 0.305: U1.8 45.66,13.12 45.3,13.12 Q1.3
N$2
  Top 0.305: U1.7 45.63,14.22 45.21,14.22 | Q1.1 43.01,14.22 45.21,14.22 | 45.21,14.22
N$3
  Top 0.305: U4.1 19.77,55.33 20.95,56.52 21.86,56.52 U9.3
N$4
  Top 0.305: U9.1 29.93,55.33 31.11,56.52 32.02,56.52 U10.3
N$5
  Top 0.305: U3.1 9.61,55.33 10.79,56.52 11.7,56.52 U4.3
N$6
  Top 0.305: U10.1 40.09,55.33 41.27,56.52 42.18,56.52 U11.3
N$7
  Top 0.406: R6.2 57.37,19.05 D2.A
N$8
  Top 0.305: U11.1 50.25,55.33 51.44,56.52 52.34,56.52 U12.3
N$9
  Top 0.305: U12.1 60.41,55.33 61.59,56.52 62.5,56.52 U13.3
N$10
  Top 0.305: U13.1 70.57,55.33 71.75,56.52 72.66,56.52 U14.3
N$11  (via drill 0.35)
  Top 0.305: U14.1 74.58,53.06 v74.93,52.7 | v81.28,31.75 87.63,31.75 88.27,31.11 88.27,29.84 87.72,29.3 U15.3
  Bottom 0.305: v81.28,31.75 81.28,50.16 78.74,52.7 v74.93,52.7
N$12
  Top 0.305: U15.1 79.29,30.39 78.11,29.21 77.2,29.21 U16.3
N$13
  Top 0.305: U16.1 69.13,30.39 67.94,29.21 67.04,29.21 U17.3
N$14
  Top 0.305: U17.1 58.97,30.39 57.78,29.21 56.88,29.21 U18.3
N$15
  Top 0.305: U18.1 48.81,30.39 47.62,29.21 46.72,29.21 U19.3
N$16
  Top 0.305: U19.1 38.65,30.39 37.47,29.21 36.56,29.21 U20.3
N$17
  Top 0.305: U20.1 28.49,30.39 27.3,29.21 26.4,29.21 U21.3
N$18
  Top 0.305: R12.2 14.39,74.73 D6.A
N$19
  Top 0.305: R3.2 27.94,71.12 LED2.A
N$20
  Top 0.305: U21.1 18.33,30.39 17.14,29.21 16.24,29.21 U22.3
N$21
  Top 0.305: R4.2 50.8,71.12 LED3.A
N$22
  Top 0.305: R15.2 72.81,74.73 D7.A
N$25
  Top 0.305: R10.1 21.36,74.68 LED8.A
N$26
  Top 0.305: R11.1 64.54,74.68 LED7.A
N$27
  Top 0.305: R5.1 52.58,4.79 50.08,4.79 49.5,5.36 J3.B5
N$30
  Top 0.305: R1.1 41.49,3.39 42.55,4.45 45.72,4.45 46.5,5.23 J3.A5
N$34
  Top 0.508: U5.2 35.67,5.83 37.47,7.62 D3.C D4.C
N$35
  Top 0.406: R13.1 24.55,4.25 D5.C
N$36
  Top 0.406: R14.1 27.94,12.48 D1.C
NEOPIX  (via drill 0.35)
  Top 0.305: U1.13 52.07,15.17 v52.07,14.61 | v83.19,49.53 76.83,49.53 72.39,53.98 3.17,53.98 2.54,54.61 2.54,55.88 1.99,56.43 U3.3
  Bottom 0.305: v52.07,14.61 53.34,13.34 81.92,13.34 83.19,14.61 v83.19,49.53
PE0  (via drill 0.35)
  Top 0.305: U1.3 44.66,17.78 46.35,17.78 v48.26,15.88
  Bottom 0.305: v48.26,15.88 48.9,15.24 TP2.TP
PE1  (via drill 0.35)
  Top 0.305: U1.6 46.15,15.88 46.99,15.88 v47.62,15.24
  Bottom 0.305: v47.62,15.24 47.62,12.7 TP1.TP
RESET  (via drill 0.35)
  Top 0.305: R2.1 C2.1 | v32.38,22.23 33.02,22.86 38.1,22.86 38.95,22.01 C2.1 | U1.29 43.25,22.86 40.22,22.86 C2.1 | v22.86,22.23 7.62,22.23 6.35,20.95 6.35,13.97 6.99,13.34 v7.62,13.34
  Bottom 0.305: v32.38,22.23 S1.4 v22.86,22.23 | v7.62,13.34 11.43,9.53 11.43,7.84 J1.1
RXI  (via drill 0.35)
  Top 0.305: v42.55,22.23 42.75,22.23 U1.30
  Top 0.406: JP3.1 v67.31,16.51
  Bottom 0.305: v67.31,16.51 62.23,16.51 56.52,22.23 v42.55,22.23
SAO_IO1  (via drill 0.35)
  Top 0.305: v53.34,14.61 53.34,16.16 U1.15 51.47,18.03 50.29,18.03 v49.53,17.27 | v82.55,50.8 87.63,55.88 87.63,60.33 86.36,61.59 J2.5
  Bottom 0.305: v53.34,14.61 53.98,13.97 81.28,13.97 82.55,15.24 v82.55,50.8 | v49.53,17.27 48.77,16.51 40.64,16.51 39.37,15.24 39.37,10.79 29.84,1.27 10.54,1.27 6.48,5.33 5.33,5.33 J1.4
SAO_IO2  (via drill 0.35)
  Top 0.305: v53.98,15.24 53.98,16.66 U1.16 52.09,18.54 v49.78,18.54 | v81.92,51.44 86.36,55.88 J2.6
  Bottom 0.305: v53.98,15.24 54.61,14.61 80.64,14.61 81.92,15.88 v81.92,51.44 | v49.78,18.54 49.53,18.54 48.13,17.14 40.01,17.14 38.73,15.88 38.73,11.43 29.21,1.91 10.79,1.91 5.59,7.11 5.59,9.18 J1.5
SCL  (via drill 0.35)
  Top 0.305: U1.28 43.11,24.13 v42.55,24.13 | v41.91,45.72 v47.62,45.72 | J2.4 v83.82,55.24
  Bottom 0.305: v42.55,24.13 42.55,45.09 v41.91,45.72 SV3.2 | v83.82,55.24 81.92,53.34 48.26,53.34 47.62,52.7 v47.62,45.72
SDA  (via drill 0.35)
  Top 0.305: U1.27 43.61,24.77 v43.18,24.77 | v82.55,55.24 82.55,60.33 83.82,61.59 J2.3
  Bottom 0.305: v43.18,24.77 43.18,47.62 | 43.18,47.62 43.81,48.26 46.35,48.26 46.99,48.9 46.99,53.34 47.62,53.98 81.28,53.98 v82.55,55.24 | 43.18,47.62 42.55,48.26 SV3.1
SIG_IN1  (via drill 0.35)
  Top 0.305: U1.32 40.28,17.78 28.57,17.78 27.94,18.41 v8.89,18.41
  Bottom 0.305: v8.89,18.41 8.89,42.55 9.53,43.18 SV2.5
SIG_IN2  (via drill 0.35)
  Top 0.305: v9.53,17.78 27.3,17.78 27.94,17.14 41.76,17.14 U1.1
  Bottom 0.305: SV2.4 10.16,40.64 9.53,40.01 v9.53,17.78
SIG_IN3  (via drill 0.35)
  Top 0.305: v10.16,17.14 26.67,17.14 27.3,16.51 42.26,16.51 U1.2
  Bottom 0.305: SV2.3 10.79,38.1 10.16,37.47 v10.16,17.14
SIG_OUT1  (via drill 0.35)
  Top 0.305: U1.9 48.83,14.04 v49.66,13.21
  Bottom 0.305: v49.66,13.21 51.12,11.75 51.44,11.43 85.72,11.43 87.63,13.34 87.63,23.5 95.25,31.11 95.25,42.55 94.61,43.18 SV1.1
SIG_OUT2  (via drill 0.35)
  Top 0.305: U1.10 50.51,13.34 v50.8,13.34
  Bottom 0.305: v50.8,13.34 52.07,12.06 85.09,12.06 87,13.97 87,24.13 94.61,31.75 94.61,40.01 93.98,40.64 SV1.2
SIG_OUT3  (via drill 0.35)
  Top 0.305: U1.11 51.01,13.97 v51.44,13.97
  Bottom 0.305: v51.44,13.97 52.7,12.7 84.45,12.7 86.36,14.61 86.36,24.77 93.98,32.38 93.98,37.47 93.34,38.1 SV1.3
TXO  (via drill 0.35)
  Top 0.305: v41.91,21.59 42.26,21.59 U1.31
  Top 0.406: JP2.1 v64.77,15.88
  Bottom 0.305: v64.77,15.88 61.59,15.88 55.88,21.59 v41.91,21.59
USB_DN  (via drill 0.35)
  Top 0.305: U8.6 53.04,8.55 v55.88,5.71 58.42,5.71 59.05,6.35 U7.6 | J3.B7 47,3.8 v47.62,3.17 48,3.55 J3.A7
  Bottom 0.305: v47.62,3.17 48.9,4.45 55.24,4.45 55.88,5.08 v55.88,5.71
USB_DP  (via drill 0.35)
  Top 0.305: U7.5 60.33,6.35 v59.05,5.08 55.24,5.08 51.69,8.64 51.69,9.14 52.07,9.53 U8.5 | J3.A6 47.5,7.5 47.75,7.75 48.26,7.75 48.5,7.5 J3.B6 48.5,3.57 v48.9,3.17
  Bottom 0.305: v59.05,5.08 59.05,3.81 58.42,3.17 v48.9,3.17
VBAT
  Top 0.508: U6.1 58.42,11.43 46.23,11.43 44.32,9.53 D4.A
VBUS
  Top 0.305: U8.4 51.45,10.18 49.66,8.38
  Top 0.406: J3.B4/A9 50.15,7.89 49.66,8.38 45.59,8.38 45.34,8.13 | 45.34,8.13 45.34,6.79 J3.A4/B9 | 45.34,8.13 45.09,8.38 41.98,8.38 D3.A
VDD  (via drill 0.35)
  Top 0.406: U2.1 29.95,9.84 R7.2 v29.84,10.79 | C21.1 32.35,11.62 U2.1 | D5.A 32.38,4.45 32.67,4.74 U5.1 32.67,6 33.66,6.99 33.66,8.93 32.75,9.84 U2.1
  Bottom 0.406: v29.84,10.79 13.34,10.79 12.06,12.06 v12.06,27.3
  pour Top (isolate 0.203): 0,59.69 74.3,59.69 75.56,58.42 75.56,53.34 74.3,52.07 16.51,52.07 12.7,48.26 12.7,39.37 20.32,31.75 86.36,31.75 87.63,30.48 87.63,27.94 86.36,26.67 3.81,26.67 7.62,30.48 7.62,45.72 0,53.34

### Text on the board
tPlace: + | - | SV2 | SV1
bPlace: [1] Connect the badge with other participants to level-up / [2] Go to the soldering village to add a screen to your badge | QUESTS | RST | + | RST | -